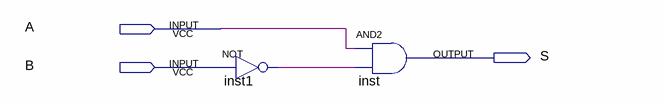
[diagram p0: schematic sheet]
// Quartus schematic MaiorQue.bdf as structural Verilog: 2 symbols, 3 pins
module MaiorQue (
  input  A,
  input  B,
  output S
);

  wire inst1_out;

  not inst1 (inst1_out, B);
  and inst (S, A, inst1_out);
endmodule
